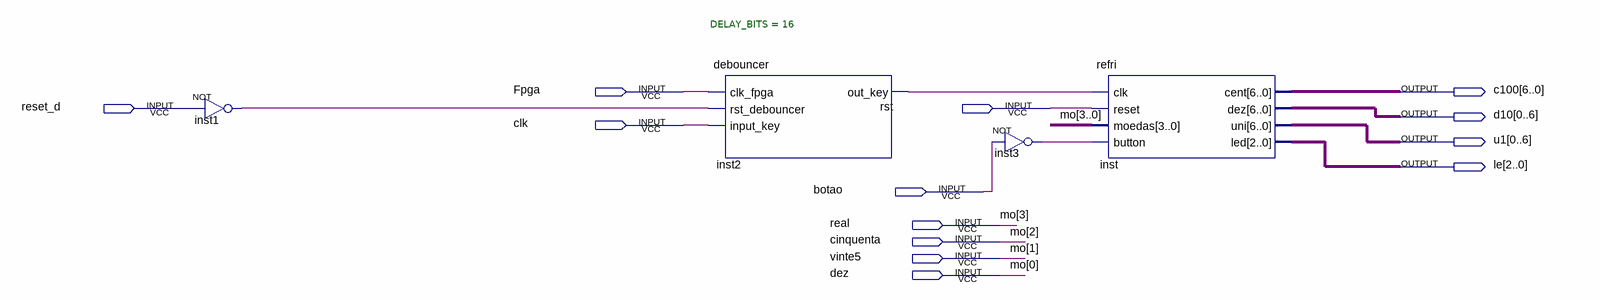
[diagram p0: schematic sheet]
// Quartus schematic maq_refri.bdf as structural Verilog: 4 symbols, 13 pins
module maq_refri (
  input  Fpga,
  input  reset_d,
  input  rst,
  input  clk,
  input  botao,
  input  \real ,
  input  cinquenta,
  input  vinte5,
  input  dez,
  output [6:0] c100,
  output [0:6] d10,
  output [0:6] u1,
  output [2:0] le
);

  wire inst1_out, inst2_out_key, inst3_out;

  not inst1 (inst1_out, reset_d);
  debouncer #(.DELAY_BITS(16)) inst2 (
    .clk_fpga(Fpga), .rst_debouncer(inst1_out), .input_key(clk), .out_key(inst2_out_key));
  not inst3 (inst3_out, botao);
  refri inst (
    .clk(inst2_out_key), .reset(rst), .moedas({\real , cinquenta, vinte5, dez}), .button(inst3_out),
    .cent(c100), .dez(d10), .uni(u1), .led(le));

  // Other names for the same wires on the sheet: mo[3:0] = {\real , cinquenta, vinte5, dez}
endmodule
